# EAGLE schematic Logitech Gamepad (EAGLE 6.4)

## Sheet 1 of 6
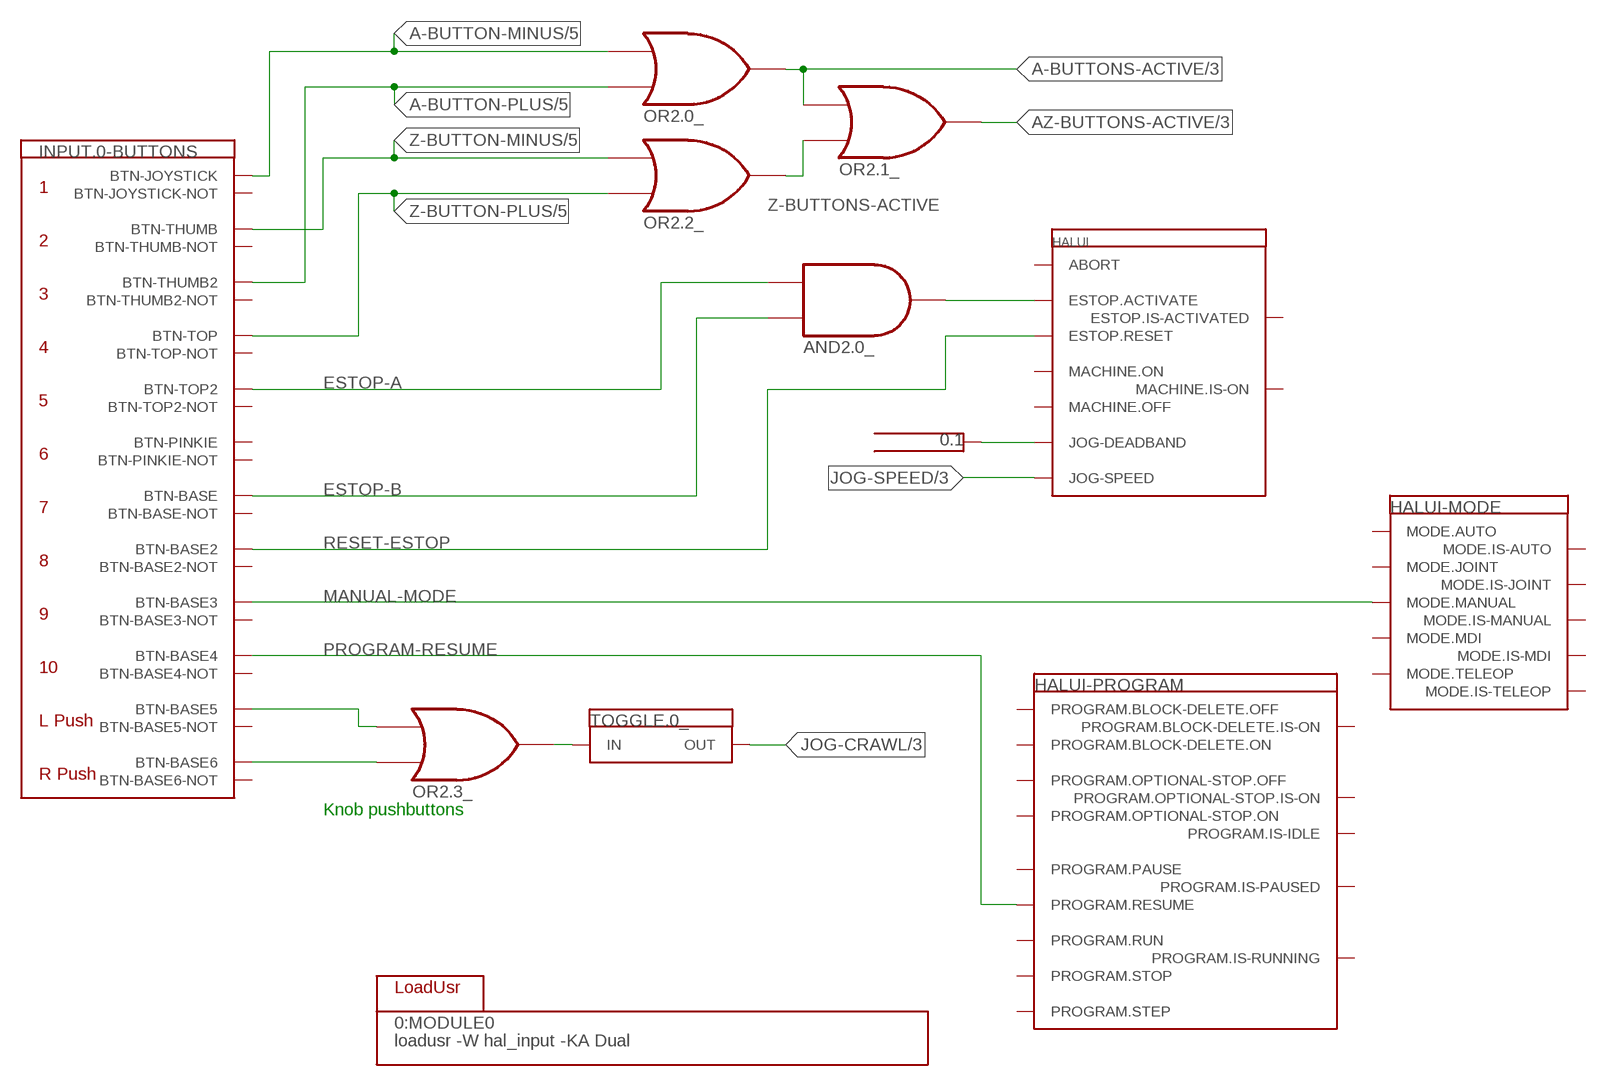
[diagram p0: schematic, sheet 1]

### Parts
AND2.0  AND2  [DUMMY]
CONSTANT.0  0.1  CONSTANT  [DUMMY]
HALUI  HALUI  [DUMMY]
INPUT.0  LOGITECH-DUAL-ACTION-GAMEPAD  [DUMMY]
OR2.0  OR2  [DUMMY]
OR2.1  OR2  [DUMMY]
OR2.2  OR2  [DUMMY]
OR2.3  OR2  [DUMMY]
TOGGLE.0  TOGGLE  [DUMMY]

### Nets
A-BUTTON-MINUS: INPUT.0.P$61(-BUTTONS:BTN-JOYSTICK) OR2.0.P$2(_:IN0) ; also sheet 5
A-BUTTON-PLUS: INPUT.0.P$67(-BUTTONS:BTN-THUMB2) OR2.0.P$3(_:IN1) ; also sheet 5
A-BUTTONS-ACTIVE: OR2.0.P$4(_:OUT) OR2.1.P$2(_:IN0) ; also sheet 3
AZ-BUTTONS-ACTIVE: OR2.1.P$4(_:OUT) ; also sheet 3,5
ESTOP-A: AND2.0.P$1(_:IN0) INPUT.0.P$71(-BUTTONS:BTN-TOP2)
ESTOP-B: AND2.0.P$2(_:IN1) INPUT.0.P$49(-BUTTONS:BTN-BASE)
JOG-CRAWL: TOGGLE.0.P$3(_:OUT) ; also sheet 3
JOG-SPEED: HALUI.P$82(JOG-SPEED) ; also sheet 3
MANUAL-MODE: HALUI.P$72(MODE.MANUAL) INPUT.0.P$53(-BUTTONS:BTN-BASE3)
N$4: AND2.0.P$3(_:OUT) HALUI.P$2(ESTOP.ACTIVATE)
N$11: INPUT.0.P$57(-BUTTONS:BTN-BASE5) OR2.3.P$2(_:IN0)
N$12: INPUT.0.P$59(-BUTTONS:BTN-BASE6) OR2.3.P$3(_:IN1)
N$15: OR2.3.P$4(_:OUT) TOGGLE.0.P$2(_:IN)
N$24: CONSTANT.0.P$2 HALUI.P$81(JOG-DEADBAND)
PROGRAM-RESUME: HALUI.P$43(PROGRAM.RESUME) INPUT.0.P$55(-BUTTONS:BTN-BASE4)
RESET-ESTOP: HALUI.P$4(ESTOP.RESET) INPUT.0.P$51(-BUTTONS:BTN-BASE2)
Z-BUTTON-MINUS: INPUT.0.P$65(-BUTTONS:BTN-THUMB) OR2.2.P$2(_:IN0) ; also sheet 5
Z-BUTTON-PLUS: INPUT.0.P$69(-BUTTONS:BTN-TOP) OR2.2.P$3(_:IN1) ; also sheet 5
Z-BUTTONS-ACTIVE: OR2.1.P$3(_:IN1) OR2.2.P$4(_:OUT)
Unconnected: HALUI.P$1(ABORT) HALUI.P$3(ESTOP.IS-ACTIVATED) HALUI.P$5(MACHINE.IS-ON) HALUI.P$6(MACHINE.OFF) HALUI.P$7(MACHINE.ON) HALUI.P$8(FLOOD.IS-ON) HALUI.P$9(FLOOD.OFF) HALUI.P$10(FLOOD.ON) HALUI.P$11(LUBE.IS-ON) HALUI.P$12(LUBE.OFF) HALUI.P$13(LUBE.ON) HALUI.P$14(MIST.IS-ON) HALUI.P$15(MIST.OFF) HALUI.P$16(MIST.ON) HALUI.P$17(FEED-OVERRIDE.COUNT-ENABLE) HALUI.P$18(FEED-OVERRIDE.COUNTS) HALUI.P$19(FEED-OVERRIDE.DECREASE) HALUI.P$20(FEED-OVERRIDE.INCREASE) HALUI.P$21(FEED-OVERRIDE.SCALE) HALUI.P$22(FEED-OVERRIDE.VALUE) HALUI.P$23(TOOL.LENGTH-OFFSET.A) HALUI.P$24(TOOL.LENGTH-OFFSET.B) HALUI.P$25(TOOL.LENGTH-OFFSET.C) HALUI.P$26(TOOL.LENGTH-OFFSET.U) HALUI.P$27(TOOL.LENGTH-OFFSET.V) HALUI.P$28(TOOL.LENGTH-OFFSET.W) HALUI.P$29(TOOL.LENGTH-OFFSET.X) HALUI.P$30(TOOL.LENGTH-OFFSET.Y) HALUI.P$31(TOOL.LENGTH-OFFSET.Z) HALUI.P$32(TOOL.NUMBER) HALUI.P$33(PROGRAM.BLOCK-DELETE.IS-ON) HALUI.P$34(PROGRAM.BLOCK-DELETE.OFF) HALUI.P$35(PROGRAM.BLOCK-DELETE.ON) HALUI.P$36(PROGRAM.IS-IDLE) HALUI.P$37(PROGRAM.IS-PAUSED) HALUI.P$38(PROGRAM.IS-RUNNING) HALUI.P$39(PROGRAM.OPTIONAL-STOP.IS-ON) HALUI.P$40(PROGRAM.OPTIONAL-STOP.OFF) HALUI.P$41(PROGRAM.OPTIONAL-STOP.ON) HALUI.P$42(PROGRAM.PAUSE) HALUI.P$44(PROGRAM.RUN) HALUI.P$45(PROGRAM.STEP) HALUI.P$46(PROGRAM.STOP) HALUI.P$47(SPINDLE-OVERRIDE.COUNT-ENABLE) HALUI.P$48(SPINDLE-OVERRIDE.COUNTS) HALUI.P$49(SPINDLE-OVERRIDE.DECREASE) HALUI.P$50(SPINDLE-OVERRIDE.INCREASE) HALUI.P$51(SPINDLE-OVERRIDE.SCALE) HALUI.P$52(SPINDLE-OVERRIDE.VALUE) HALUI.P$53(SPINDLE.BRAKE-IS-ON) HALUI.P$54(SPINDLE.BRAKE.OFF) HALUI.P$55(SPINDLE.BRAKE.ON) HALUI.P$56(SPINDLE.DECREASE) HALUI.P$57(SPINDLE.FORWARD) HALUI.P$58(SPINDLE.INCREASE) HALUI.P$59(SPINDLE.IS-ON) HALUI.P$60(SPINDLE.REVERSE) HALUI.P$61(SPINDLE.RUNS-BACKWARD) HALUI.P$62(SPINDLE.RUNS-FORWARD) HALUI.P$63(SPINDLE.START) HALUI.P$64(SPINDLE.STOP) HALUI.P$65(MODE.AUTO) HALUI.P$66(MODE.IS-AUTO) HALUI.P$67(MODE.IS-JOINT) HALUI.P$68(MODE.IS-MANUAL) HALUI.P$69(MODE.IS-MDI) HALUI.P$70(MODE.IS-TELEOP) HALUI.P$71(MODE.JOINT) HALUI.P$73(MODE.MDI) HALUI.P$74(MODE.TELEOP) HALUI.P$75(MAX-VELOCITY.COUNT-ENABLE) HALUI.P$76(MAX-VELOCITY.COUNTS) HALUI.P$77(MAX-VELOCITY.DECREASE) HALUI.P$78(MAX-VELOCITY.INCREASE) HALUI.P$79(MAX-VELOCITY.SCALE) HALUI.P$80(MAX-VELOCITY.VALUE) INPUT.0.P$50(-BUTTONS:BTN-BASE-NOT) INPUT.0.P$52(-BUTTONS:BTN-BASE2-NOT) INPUT.0.P$54(-BUTTONS:BTN-BASE3-NOT) INPUT.0.P$56(-BUTTONS:BTN-BASE4-NOT) INPUT.0.P$58(-BUTTONS:BTN-BASE5-NOT) INPUT.0.P$60(-BUTTONS:BTN-BASE6-NOT) INPUT.0.P$62(-BUTTONS:BTN-JOYSTICK-NOT) INPUT.0.P$63(-BUTTONS:BTN-PINKIE) INPUT.0.P$64(-BUTTONS:BTN-PINKIE-NOT) INPUT.0.P$66(-BUTTONS:BTN-THUMB-NOT) INPUT.0.P$68(-BUTTONS:BTN-THUMB2-NOT) INPUT.0.P$70(-BUTTONS:BTN-TOP-NOT) INPUT.0.P$72(-BUTTONS:BTN-TOP2-NOT) INPUT.0.P$73(.ABS-HAT0X-MAX:PIN_PARAMETER) INPUT.0.P$74(.ABS-HAT0X-MIN:PIN_PARAMETER) INPUT.0.P$75(.ABS-HAT0Y-MAX:PIN_PARAMETER) INPUT.0.P$76(.ABS-HAT0Y-MIN:PIN_PARAMETER) INPUT.0.P$77(.ABS-RZ-MAX:PIN_PARAMETER) INPUT.0.P$78(.ABS-RZ-MIN:PIN_PARAMETER) INPUT.0.P$79(.ABS-X-MAX:PIN_PARAMETER) INPUT.0.P$80(.ABS-X-MIN:PIN_PARAMETER) INPUT.0.P$81(.ABS-Y-MAX:PIN_PARAMETER) INPUT.0.P$82(.ABS-Y-MIN:PIN_PARAMETER) INPUT.0.P$83(.ABS-Z-MAX:PIN_PARAMETER) INPUT.0.P$84(.ABS-Z-MIN:PIN_PARAMETER) TOGGLE.0.P$4(.DEBOUNCE:PIN_PARAMETER)

### Notes on the sheet
- Knob pushbuttons

## Sheet 2 of 6
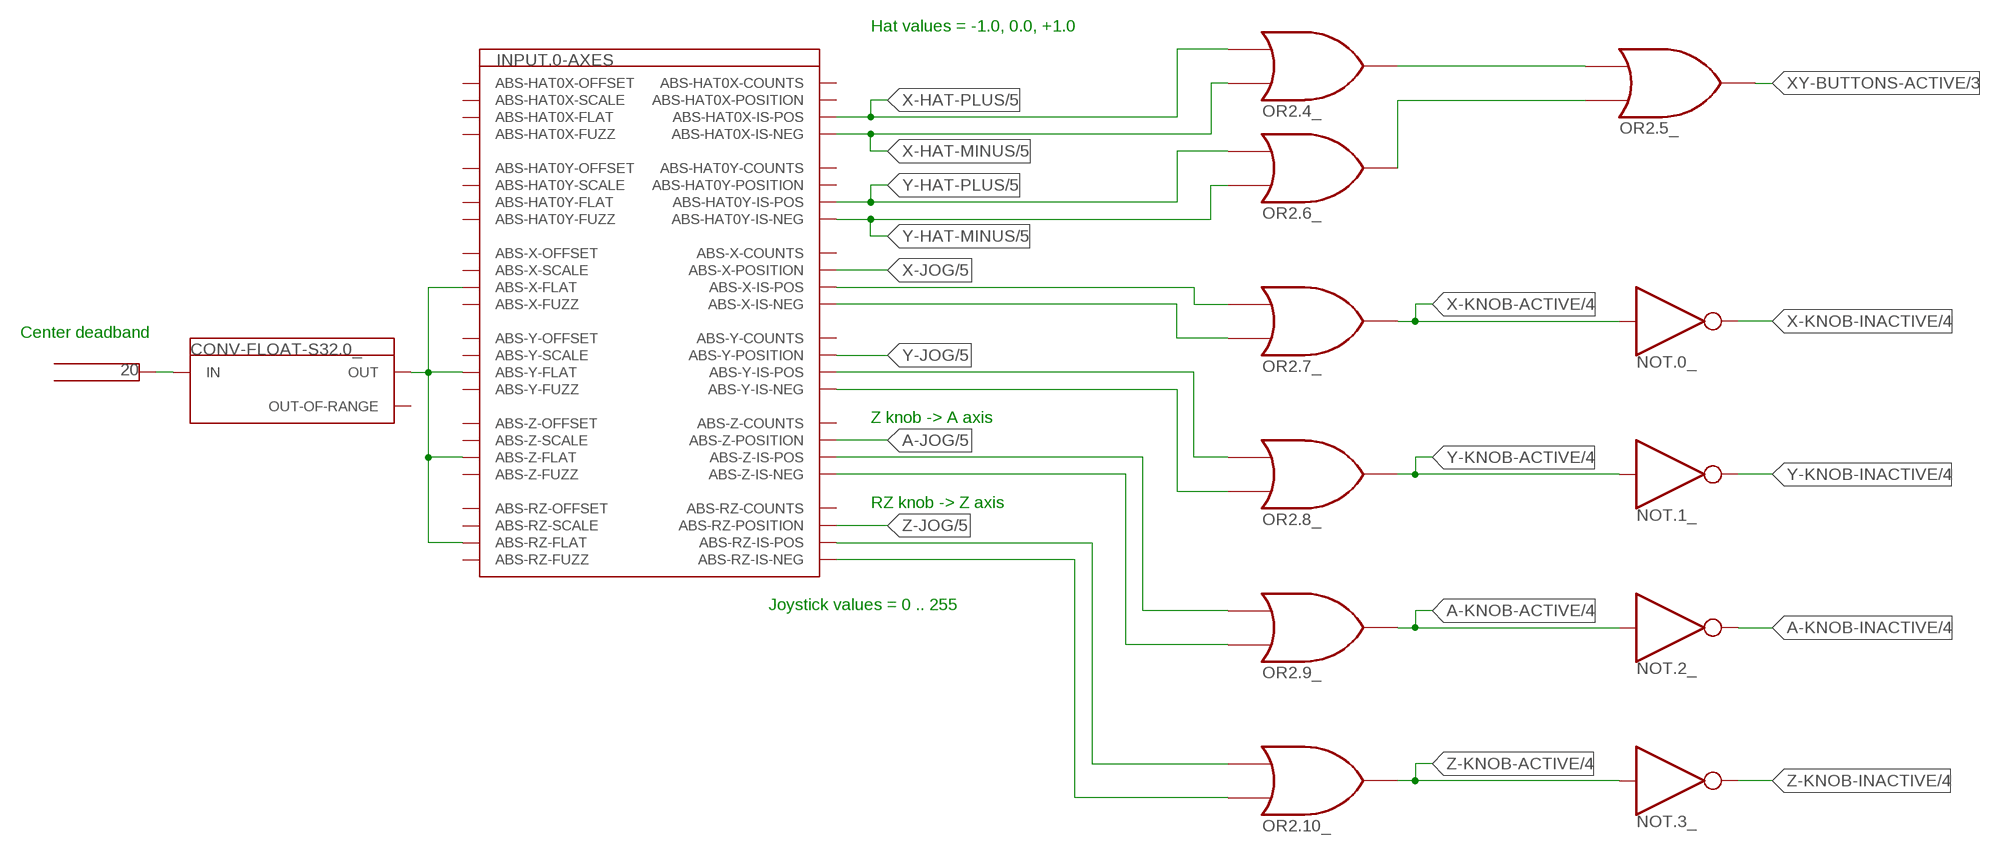
[diagram p1: schematic, sheet 2]

### Parts
CONSTANT.1  20  CONSTANT  [DUMMY]
CONV-FLOAT-S32.0  CONV_FLOAT_S32  [DUMMY]
NOT.0  NOT  [DUMMY]
NOT.1  NOT  [DUMMY]
NOT.2  NOT  [DUMMY]
NOT.3  NOT  [DUMMY]
OR2.4  OR2  [DUMMY]
OR2.5  OR2  [DUMMY]
OR2.6  OR2  [DUMMY]
OR2.7  OR2  [DUMMY]
OR2.8  OR2  [DUMMY]
OR2.9  OR2  [DUMMY]
OR2.10  OR2  [DUMMY]

### Nets
A-JOG: INPUT.0.P$47(-AXES:ABS-Z-POSITION) ; also sheet 5
A-KNOB-ACTIVE: NOT.2.P$1(_:IN) OR2.9.P$4(_:OUT) ; also sheet 4
A-KNOB-INACTIVE: NOT.2.P$2(_:OUT) ; also sheet 4
N$6: CONV-FLOAT-S32.0.P$4(_:OUT) INPUT.0.P$18(-AXES:ABS-RZ-FLAT) INPUT.0.P$26(-AXES:ABS-X-FLAT) INPUT.0.P$34(-AXES:ABS-Y-FLAT) INPUT.0.P$42(-AXES:ABS-Z-FLAT)
N$8: CONSTANT.1.P$2 CONV-FLOAT-S32.0.P$3(_:IN)
N$42: INPUT.0.P$29(-AXES:ABS-X-IS-POS) OR2.7.P$2(_:IN0)
N$43: INPUT.0.P$28(-AXES:ABS-X-IS-NEG) OR2.7.P$3(_:IN1)
N$44: INPUT.0.P$37(-AXES:ABS-Y-IS-POS) OR2.8.P$2(_:IN0)
N$45: INPUT.0.P$36(-AXES:ABS-Y-IS-NEG) OR2.8.P$3(_:IN1)
N$46: INPUT.0.P$45(-AXES:ABS-Z-IS-POS) OR2.9.P$2(_:IN0)
N$47: INPUT.0.P$44(-AXES:ABS-Z-IS-NEG) OR2.9.P$3(_:IN1)
N$48: INPUT.0.P$21(-AXES:ABS-RZ-IS-POS) OR2.10.P$2(_:IN0)
N$49: INPUT.0.P$20(-AXES:ABS-RZ-IS-NEG) OR2.10.P$3(_:IN1)
X-BUTTONS-ACTIVE: OR2.4.P$4(_:OUT) OR2.5.P$2(_:IN0)
X-HAT-MINUS: INPUT.0.P$4(-AXES:ABS-HAT0X-IS-NEG) OR2.4.P$3(_:IN1) ; also sheet 5
X-HAT-PLUS: INPUT.0.P$5(-AXES:ABS-HAT0X-IS-POS) OR2.4.P$2(_:IN0) ; also sheet 5
X-JOG: INPUT.0.P$31(-AXES:ABS-X-POSITION) ; also sheet 5
X-KNOB-ACTIVE: NOT.0.P$1(_:IN) OR2.7.P$4(_:OUT) ; also sheet 4
X-KNOB-INACTIVE: NOT.0.P$2(_:OUT) ; also sheet 4
XY-BUTTONS-ACTIVE: OR2.5.P$4(_:OUT) ; also sheet 3,5
Y-BUTTONS-ACTIVE: OR2.5.P$3(_:IN1) OR2.6.P$4(_:OUT)
Y-HAT-MINUS: INPUT.0.P$16(-AXES:ABS-HAT0Y-IS-NEG) OR2.6.P$3(_:IN1) ; also sheet 5
Y-HAT-PLUS: INPUT.0.P$12(-AXES:ABS-HAT0Y-IS-POS) OR2.6.P$2(_:IN0) ; also sheet 5
Y-JOG: INPUT.0.P$39(-AXES:ABS-Y-POSITION) ; also sheet 5
Y-KNOB-ACTIVE: NOT.1.P$1(_:IN) OR2.8.P$4(_:OUT) ; also sheet 4
Y-KNOB-INACTIVE: NOT.1.P$2(_:OUT) ; also sheet 4
Z-JOG: INPUT.0.P$23(-AXES:ABS-RZ-POSITION) ; also sheet 5
Z-KNOB-ACTIVE: NOT.3.P$1(_:IN) OR2.10.P$4(_:OUT) ; also sheet 4
Z-KNOB-INACTIVE: NOT.3.P$2(_:OUT) ; also sheet 4
Unconnected: CONV-FLOAT-S32.0.P$2(.CLAMP:PIN_PARAMETER) CONV-FLOAT-S32.0.P$5(_:OUT-OF-RANGE) INPUT.0.P$1(-AXES:ABS-HAT0X-COUNTS) INPUT.0.P$2(-AXES:ABS-HAT0X-FLAT) INPUT.0.P$3(-AXES:ABS-HAT0X-FUZZ) INPUT.0.P$6(-AXES:ABS-HAT0X-OFFSET) INPUT.0.P$7(-AXES:ABS-HAT0X-POSITION) INPUT.0.P$8(-AXES:ABS-HAT0X-SCALE) INPUT.0.P$9(-AXES:ABS-HAT0Y-COUNTS) INPUT.0.P$10(-AXES:ABS-HAT0Y-FLAT) INPUT.0.P$11(-AXES:ABS-HAT0Y-FUZZ) INPUT.0.P$13(-AXES:ABS-HAT0Y-OFFSET) INPUT.0.P$14(-AXES:ABS-HAT0Y-POSITION) INPUT.0.P$15(-AXES:ABS-HAT0Y-SCALE) INPUT.0.P$17(-AXES:ABS-RZ-COUNTS) INPUT.0.P$19(-AXES:ABS-RZ-FUZZ) INPUT.0.P$22(-AXES:ABS-RZ-OFFSET) INPUT.0.P$24(-AXES:ABS-RZ-SCALE) INPUT.0.P$25(-AXES:ABS-X-COUNTS) INPUT.0.P$27(-AXES:ABS-X-FUZZ) INPUT.0.P$30(-AXES:ABS-X-OFFSET) INPUT.0.P$32(-AXES:ABS-X-SCALE) INPUT.0.P$33(-AXES:ABS-Y-COUNTS) INPUT.0.P$35(-AXES:ABS-Y-FUZZ) INPUT.0.P$38(-AXES:ABS-Y-OFFSET) INPUT.0.P$40(-AXES:ABS-Y-SCALE) INPUT.0.P$41(-AXES:ABS-Z-COUNTS) INPUT.0.P$43(-AXES:ABS-Z-FUZZ) INPUT.0.P$46(-AXES:ABS-Z-OFFSET) INPUT.0.P$48(-AXES:ABS-Z-SCALE)

### Notes on the sheet
- Hat values = -1.0, 0.0, +1.0
- Center deadband
- Z knob -> A axis
- RZ knob -> Z axis
- Joystick values = 0 .. 255

## Sheet 3 of 6
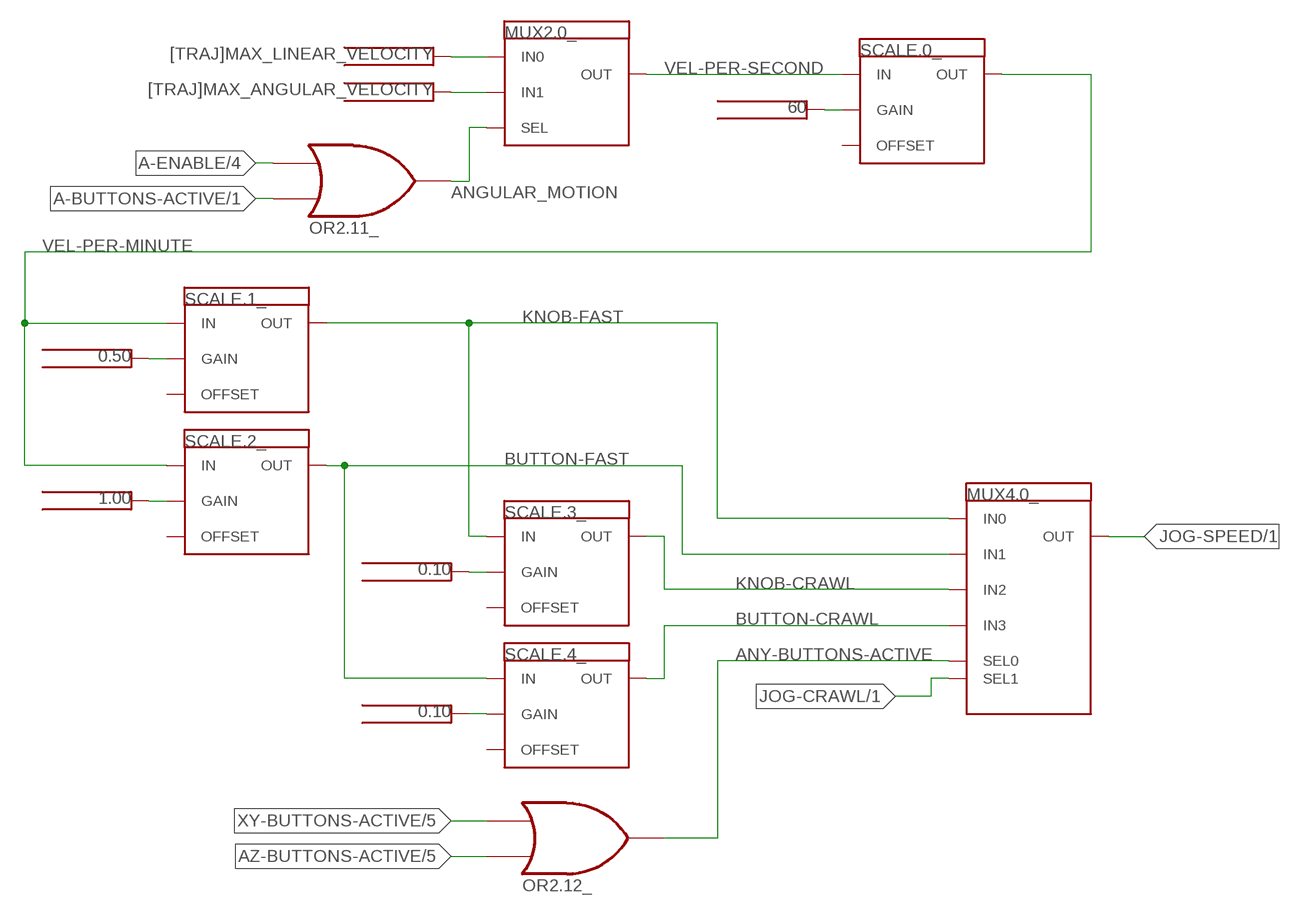
[diagram p2: schematic, sheet 3]

### Parts
CONSTANT.2  [TRAJ]MAX_LINEAR_VELOCITY  CONSTANT  [DUMMY]
CONSTANT.3  [TRAJ]MAX_ANGULAR_VELOCITY  CONSTANT  [DUMMY]
CONSTANT.4  60  CONSTANT  [DUMMY]
CONSTANT.5  0.50  CONSTANT  [DUMMY]
CONSTANT.6  1.00  CONSTANT  [DUMMY]
CONSTANT.7  0.10  CONSTANT  [DUMMY]
CONSTANT.8  0.10  CONSTANT  [DUMMY]
MUX2.0  MUX2  [DUMMY]
MUX4.0  MUX4  [DUMMY]
OR2.11  OR2  [DUMMY]
OR2.12  OR2  [DUMMY]
SCALE.0  SCALE  [DUMMY]
SCALE.1  SCALE  [DUMMY]
SCALE.2  SCALE  [DUMMY]
SCALE.3  SCALE  [DUMMY]
SCALE.4  SCALE  [DUMMY]

### Nets
A-BUTTONS-ACTIVE: OR2.11.P$3(_:IN1) ; also sheet 1
A-ENABLE: OR2.11.P$2(_:IN0) ; also sheet 4,5
ANGULAR_MOTION: MUX2.0.P$5(_:SEL) OR2.11.P$4(_:OUT)
ANY-BUTTONS-ACTIVE: MUX4.0.P$7(_:SEL0) OR2.12.P$4(_:OUT)
AZ-BUTTONS-ACTIVE: OR2.12.P$3(_:IN1) ; also sheet 1,5
BUTTON-CRAWL: MUX4.0.P$5(_:IN3) SCALE.4.P$5(_:OUT)
BUTTON-FAST: MUX4.0.P$3(_:IN1) SCALE.2.P$5(_:OUT) SCALE.4.P$3(_:IN)
JOG-CRAWL: MUX4.0.P$8(_:SEL1) ; also sheet 1
JOG-SPEED: MUX4.0.P$6(_:OUT) ; also sheet 1
KNOB-CRAWL: MUX4.0.P$4(_:IN2) SCALE.3.P$5(_:OUT)
KNOB-FAST: MUX4.0.P$2(_:IN0) SCALE.1.P$5(_:OUT) SCALE.3.P$3(_:IN)
N$1: CONSTANT.2.P$2 MUX2.0.P$2(_:IN0)
N$9: CONSTANT.3.P$2 MUX2.0.P$3(_:IN1)
N$16: CONSTANT.4.P$2 SCALE.0.P$2(_:GAIN)
N$17: CONSTANT.5.P$2 SCALE.1.P$2(_:GAIN)
N$18: CONSTANT.6.P$2 SCALE.2.P$2(_:GAIN)
N$19: CONSTANT.7.P$2 SCALE.3.P$2(_:GAIN)
N$20: CONSTANT.8.P$2 SCALE.4.P$2(_:GAIN)
VEL-PER-MINUTE: SCALE.0.P$5(_:OUT) SCALE.1.P$3(_:IN) SCALE.2.P$3(_:IN)
VEL-PER-SECOND: MUX2.0.P$4(_:OUT) SCALE.0.P$3(_:IN)
XY-BUTTONS-ACTIVE: OR2.12.P$2(_:IN0) ; also sheet 2,5
Unconnected: SCALE.0.P$4(_:OFFSET) SCALE.1.P$4(_:OFFSET) SCALE.2.P$4(_:OFFSET) SCALE.3.P$4(_:OFFSET) SCALE.4.P$4(_:OFFSET)

## Sheet 4 of 6
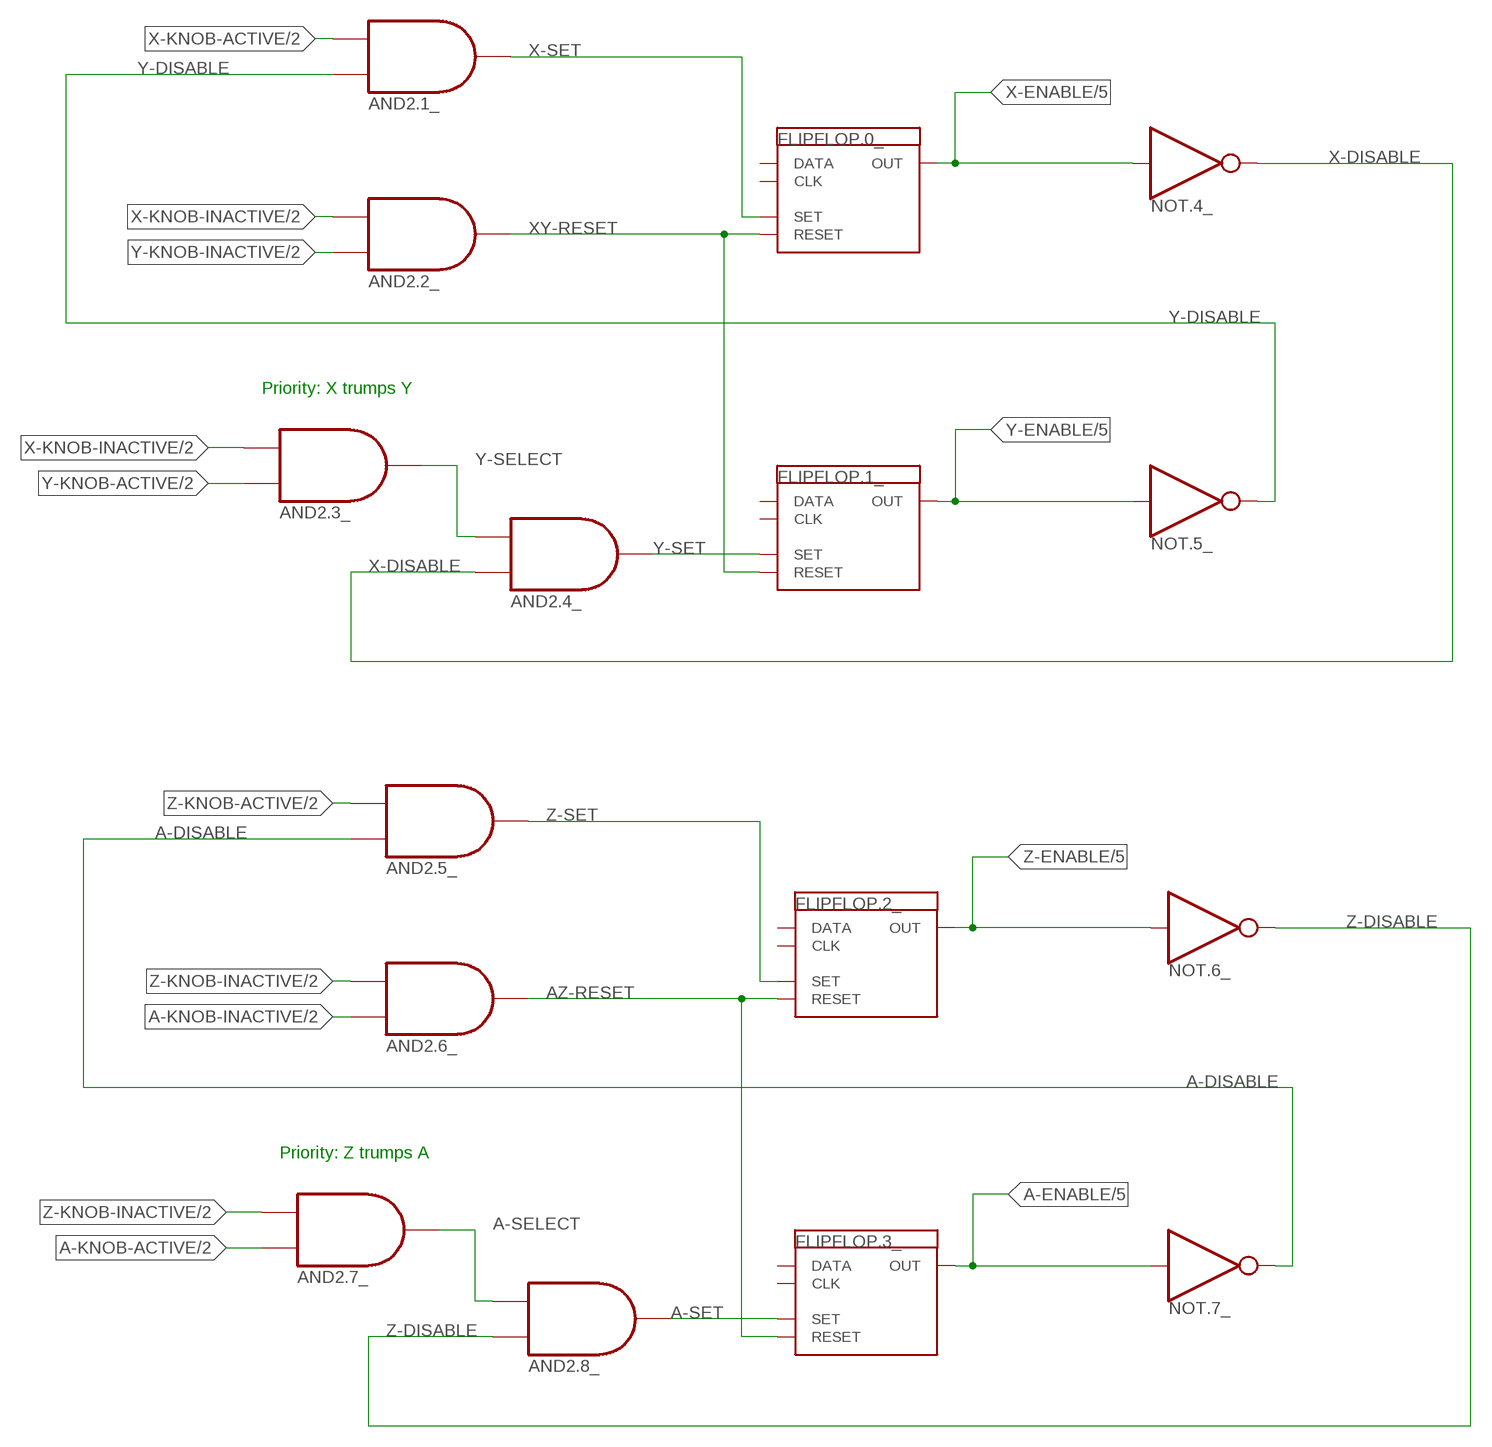
[diagram p3: schematic, sheet 4]

### Parts
AND2.1  AND2  [DUMMY]
AND2.2  AND2  [DUMMY]
AND2.3  AND2  [DUMMY]
AND2.4  AND2  [DUMMY]
AND2.5  AND2  [DUMMY]
AND2.6  AND2  [DUMMY]
AND2.7  AND2  [DUMMY]
AND2.8  AND2  [DUMMY]
FLIPFLOP.0  FLIPFLOP  [DUMMY]
FLIPFLOP.1  FLIPFLOP  [DUMMY]
FLIPFLOP.2  FLIPFLOP  [DUMMY]
FLIPFLOP.3  FLIPFLOP  [DUMMY]
NOT.4  NOT  [DUMMY]
NOT.5  NOT  [DUMMY]
NOT.6  NOT  [DUMMY]
NOT.7  NOT  [DUMMY]

### Nets
A-DISABLE: AND2.5.P$2(_:IN1) NOT.7.P$2(_:OUT)
A-ENABLE: FLIPFLOP.3.P$3(_:OUT) NOT.7.P$1(_:IN) ; also sheet 3,5
A-KNOB-ACTIVE: AND2.7.P$2(_:IN1) ; also sheet 2
A-KNOB-INACTIVE: AND2.6.P$2(_:IN1) ; also sheet 2
A-SELECT: AND2.7.P$3(_:OUT) AND2.8.P$1(_:IN0)
A-SET: AND2.8.P$3(_:OUT) FLIPFLOP.3.P$5(_:SET)
AZ-RESET: AND2.6.P$3(_:OUT) FLIPFLOP.2.P$4(_:RESET) FLIPFLOP.3.P$4(_:RESET)
X-DISABLE: AND2.4.P$2(_:IN1) NOT.4.P$2(_:OUT)
X-ENABLE: FLIPFLOP.0.P$3(_:OUT) NOT.4.P$1(_:IN) ; also sheet 5
X-KNOB-ACTIVE: AND2.1.P$1(_:IN0) ; also sheet 2
X-KNOB-INACTIVE: AND2.2.P$1(_:IN0) AND2.3.P$1(_:IN0) ; also sheet 2
X-SET: AND2.1.P$3(_:OUT) FLIPFLOP.0.P$5(_:SET)
XY-RESET: AND2.2.P$3(_:OUT) FLIPFLOP.0.P$4(_:RESET) FLIPFLOP.1.P$4(_:RESET)
Y-DISABLE: AND2.1.P$2(_:IN1) NOT.5.P$2(_:OUT)
Y-ENABLE: FLIPFLOP.1.P$3(_:OUT) NOT.5.P$1(_:IN) ; also sheet 5
Y-KNOB-ACTIVE: AND2.3.P$2(_:IN1) ; also sheet 2
Y-KNOB-INACTIVE: AND2.2.P$2(_:IN1) ; also sheet 2
Y-SELECT: AND2.3.P$3(_:OUT) AND2.4.P$1(_:IN0)
Y-SET: AND2.4.P$3(_:OUT) FLIPFLOP.1.P$5(_:SET)
Z-DISABLE: AND2.8.P$2(_:IN1) NOT.6.P$2(_:OUT)
Z-ENABLE: FLIPFLOP.2.P$3(_:OUT) NOT.6.P$1(_:IN) ; also sheet 5
Z-KNOB-ACTIVE: AND2.5.P$1(_:IN0) ; also sheet 2
Z-KNOB-INACTIVE: AND2.6.P$1(_:IN0) AND2.7.P$1(_:IN0) ; also sheet 2
Z-SET: AND2.5.P$3(_:OUT) FLIPFLOP.2.P$5(_:SET)
Unconnected: FLIPFLOP.0.P$1(_:CLK) FLIPFLOP.0.P$2(_:DATA) FLIPFLOP.1.P$1(_:CLK) FLIPFLOP.1.P$2(_:DATA) FLIPFLOP.2.P$1(_:CLK) FLIPFLOP.2.P$2(_:DATA) FLIPFLOP.3.P$1(_:CLK) FLIPFLOP.3.P$2(_:DATA)

### Notes on the sheet
- Priority: X trumps Y
- Priority: Z trumps A

## Sheet 5 of 6
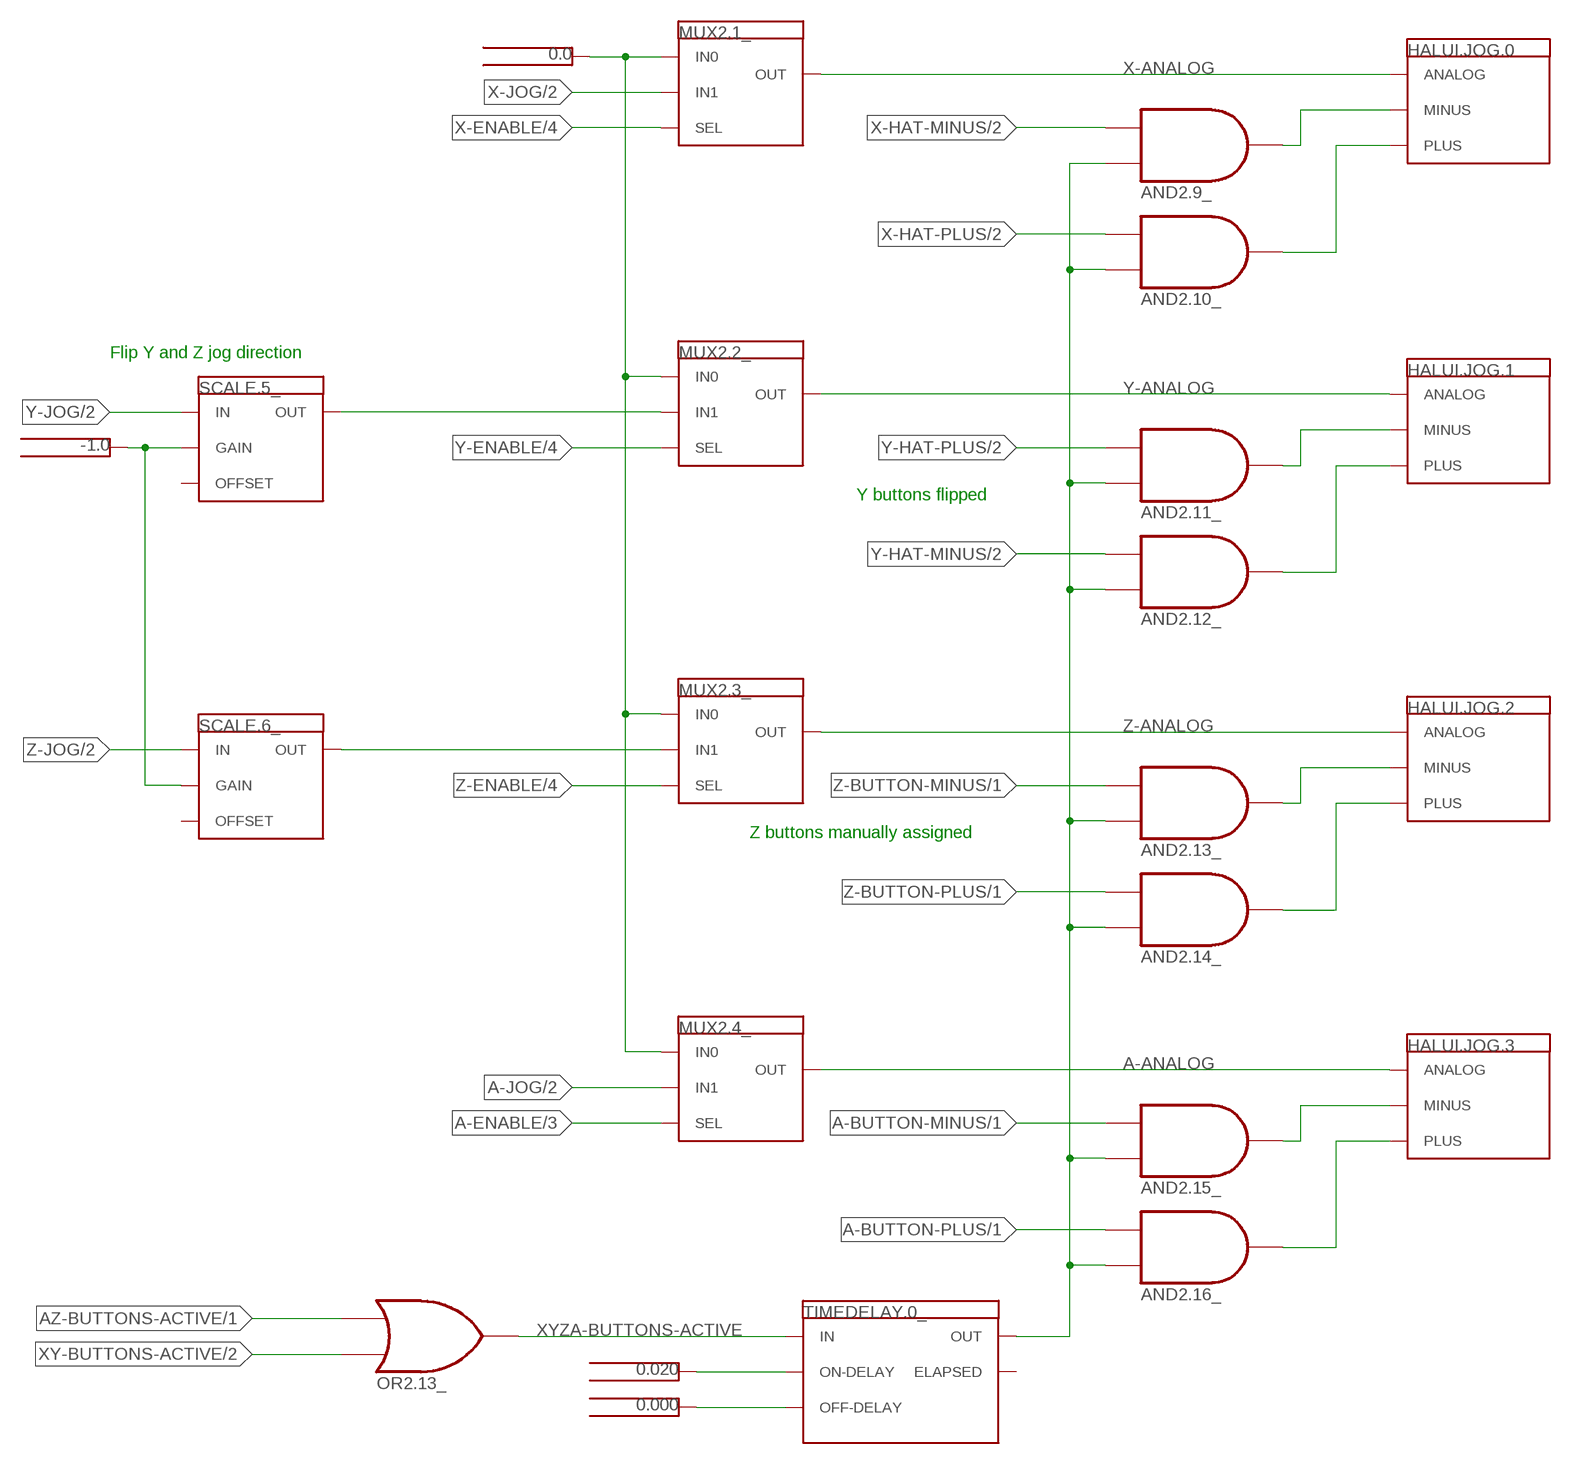
[diagram p4: schematic, sheet 5]

### Parts
AND2.9  AND2  [DUMMY]
AND2.10  AND2  [DUMMY]
AND2.11  AND2  [DUMMY]
AND2.12  AND2  [DUMMY]
AND2.13  AND2  [DUMMY]
AND2.14  AND2  [DUMMY]
AND2.15  AND2  [DUMMY]
AND2.16  AND2  [DUMMY]
CONSTANT.9  0.0  CONSTANT  [DUMMY]
CONSTANT.10  -1.0  CONSTANT  [DUMMY]
CONSTANT.11  0.020  CONSTANT  [DUMMY]
CONSTANT.12  0.000  CONSTANT  [DUMMY]
HALUI.JOG.0  HALUI.JOG  [DUMMY]
HALUI.JOG.1  HALUI.JOG  [DUMMY]
HALUI.JOG.2  HALUI.JOG  [DUMMY]
HALUI.JOG.3  HALUI.JOG  [DUMMY]
MUX2.1  MUX2  [DUMMY]
MUX2.2  MUX2  [DUMMY]
MUX2.3  MUX2  [DUMMY]
MUX2.4  MUX2  [DUMMY]
OR2.13  OR2  [DUMMY]
SCALE.5  SCALE  [DUMMY]
SCALE.6  SCALE  [DUMMY]
TIMEDELAY.0  TIMEDELAY  [DUMMY]

### Nets
A-ANALOG: HALUI.JOG.3.P$1(ANALOG) MUX2.4.P$4(_:OUT)
A-BUTTON-MINUS: AND2.15.P$1(_:IN0) ; also sheet 1
A-BUTTON-PLUS: AND2.16.P$1(_:IN0) ; also sheet 1
A-ENABLE: MUX2.4.P$5(_:SEL) ; also sheet 3,4
A-JOG: MUX2.4.P$3(_:IN1) ; also sheet 2
AZ-BUTTONS-ACTIVE: OR2.13.P$2(_:IN0) ; also sheet 1,3
N$10: CONSTANT.10.P$2 SCALE.5.P$2(_:GAIN) SCALE.6.P$2(_:GAIN)
N$13: CONSTANT.9.P$2 MUX2.1.P$2(_:IN0) MUX2.2.P$2(_:IN0) MUX2.3.P$2(_:IN0) MUX2.4.P$2(_:IN0)
N$22: MUX2.2.P$3(_:IN1) SCALE.5.P$5(_:OUT)
N$23: MUX2.3.P$3(_:IN1) SCALE.6.P$5(_:OUT)
N$29: AND2.9.P$2(_:IN1) AND2.10.P$2(_:IN1) AND2.11.P$2(_:IN1) AND2.12.P$2(_:IN1) AND2.13.P$2(_:IN1) AND2.14.P$2(_:IN1) AND2.15.P$2(_:IN1) AND2.16.P$2(_:IN1) TIMEDELAY.0.P$5(OUT)
N$30: AND2.9.P$3(_:OUT) HALUI.JOG.0.P$2(MINUS)
N$32: CONSTANT.11.P$2 TIMEDELAY.0.P$4(ON-DELAY)
N$33: CONSTANT.12.P$2 TIMEDELAY.0.P$3(OFF-DELAY)
N$34: AND2.10.P$3(_:OUT) HALUI.JOG.0.P$3(PLUS)
N$35: AND2.11.P$3(_:OUT) HALUI.JOG.1.P$2(MINUS)
N$36: AND2.12.P$3(_:OUT) HALUI.JOG.1.P$3(PLUS)
N$37: AND2.13.P$3(_:OUT) HALUI.JOG.2.P$2(MINUS)
N$38: AND2.14.P$3(_:OUT) HALUI.JOG.2.P$3(PLUS)
N$39: AND2.15.P$3(_:OUT) HALUI.JOG.3.P$2(MINUS)
N$40: AND2.16.P$3(_:OUT) HALUI.JOG.3.P$3(PLUS)
X-ANALOG: HALUI.JOG.0.P$1(ANALOG) MUX2.1.P$4(_:OUT)
X-ENABLE: MUX2.1.P$5(_:SEL) ; also sheet 4
X-HAT-MINUS: AND2.9.P$1(_:IN0) ; also sheet 2
X-HAT-PLUS: AND2.10.P$1(_:IN0) ; also sheet 2
X-JOG: MUX2.1.P$3(_:IN1) ; also sheet 2
XY-BUTTONS-ACTIVE: OR2.13.P$3(_:IN1) ; also sheet 2,3
XYZA-BUTTONS-ACTIVE: OR2.13.P$4(_:OUT) TIMEDELAY.0.P$2(IN)
Y-ANALOG: HALUI.JOG.1.P$1(ANALOG) MUX2.2.P$4(_:OUT)
Y-ENABLE: MUX2.2.P$5(_:SEL) ; also sheet 4
Y-HAT-MINUS: AND2.12.P$1(_:IN0) ; also sheet 2
Y-HAT-PLUS: AND2.11.P$1(_:IN0) ; also sheet 2
Y-JOG: SCALE.5.P$3(_:IN) ; also sheet 2
Z-ANALOG: HALUI.JOG.2.P$1(ANALOG) MUX2.3.P$4(_:OUT)
Z-BUTTON-MINUS: AND2.13.P$1(_:IN0) ; also sheet 1
Z-BUTTON-PLUS: AND2.14.P$1(_:IN0) ; also sheet 1
Z-ENABLE: MUX2.3.P$5(_:SEL) ; also sheet 4
Z-JOG: SCALE.6.P$3(_:IN) ; also sheet 2
Unconnected: SCALE.5.P$4(_:OFFSET) SCALE.6.P$4(_:OFFSET) TIMEDELAY.0.P$1(ELAPSED)

### Notes on the sheet
- Flip Y and Z jog direction
- Y buttons flipped
- Z buttons manually assigned

## Sheet 6 of 6
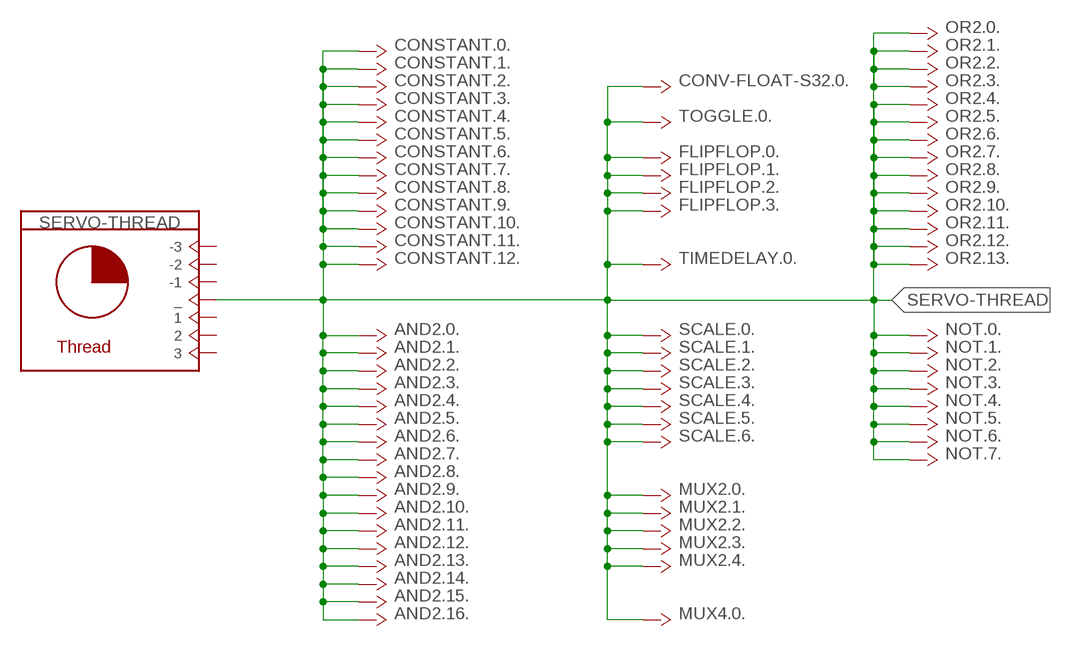
[diagram p5: schematic, sheet 6]

### Parts
SERVO-THREAD  THREAD  [DUMMY]

### Nets
SERVO-THREAD: AND2.0.P$4(.:PIN_THREAD) AND2.1.P$4(.:PIN_THREAD) AND2.2.P$4(.:PIN_THREAD) AND2.3.P$4(.:PIN_THREAD) AND2.4.P$4(.:PIN_THREAD) AND2.5.P$4(.:PIN_THREAD) AND2.6.P$4(.:PIN_THREAD) AND2.7.P$4(.:PIN_THREAD) AND2.8.P$4(.:PIN_THREAD) AND2.9.P$4(.:PIN_THREAD) AND2.10.P$4(.:PIN_THREAD) AND2.11.P$4(.:PIN_THREAD) AND2.12.P$4(.:PIN_THREAD) AND2.13.P$4(.:PIN_THREAD) AND2.14.P$4(.:PIN_THREAD) AND2.15.P$4(.:PIN_THREAD) AND2.16.P$4(.:PIN_THREAD) CONSTANT.0.P$1 CONSTANT.1.P$1 CONSTANT.2.P$1 CONSTANT.3.P$1 CONSTANT.4.P$1 CONSTANT.5.P$1 CONSTANT.6.P$1 CONSTANT.7.P$1 CONSTANT.8.P$1 CONSTANT.9.P$1 CONSTANT.10.P$1 CONSTANT.11.P$1 CONSTANT.12.P$1 CONV-FLOAT-S32.0.P$1(.:PIN_THREAD) FLIPFLOP.0.P$6(.:PIN_THREAD) FLIPFLOP.1.P$6(.:PIN_THREAD) FLIPFLOP.2.P$6(.:PIN_THREAD) FLIPFLOP.3.P$6(.:PIN_THREAD) MUX2.0.P$1(.:PIN_THREAD) MUX2.1.P$1(.:PIN_THREAD) MUX2.2.P$1(.:PIN_THREAD) MUX2.3.P$1(.:PIN_THREAD) MUX2.4.P$1(.:PIN_THREAD) MUX4.0.P$1(.:PIN_THREAD) NOT.0.P$3(.:PIN_THREAD) NOT.1.P$3(.:PIN_THREAD) NOT.2.P$3(.:PIN_THREAD) NOT.3.P$3(.:PIN_THREAD) NOT.4.P$3(.:PIN_THREAD) NOT.5.P$3(.:PIN_THREAD) NOT.6.P$3(.:PIN_THREAD) NOT.7.P$3(.:PIN_THREAD) OR2.0.P$1(.:PIN_THREAD) OR2.1.P$1(.:PIN_THREAD) OR2.2.P$1(.:PIN_THREAD) OR2.3.P$1(.:PIN_THREAD) OR2.4.P$1(.:PIN_THREAD) OR2.5.P$1(.:PIN_THREAD) OR2.6.P$1(.:PIN_THREAD) OR2.7.P$1(.:PIN_THREAD) OR2.8.P$1(.:PIN_THREAD) OR2.9.P$1(.:PIN_THREAD) OR2.10.P$1(.:PIN_THREAD) OR2.11.P$1(.:PIN_THREAD) OR2.12.P$1(.:PIN_THREAD) OR2.13.P$1(.:PIN_THREAD) SCALE.0.P$1(.:PIN_THREAD) SCALE.1.P$1(.:PIN_THREAD) SCALE.2.P$1(.:PIN_THREAD) SCALE.3.P$1(.:PIN_THREAD) SCALE.4.P$1(.:PIN_THREAD) SCALE.5.P$1(.:PIN_THREAD) SCALE.6.P$1(.:PIN_THREAD) SERVO-THREAD.P$7(_) TIMEDELAY.0.P$6(PIN_THREAD) TOGGLE.0.P$1(.:PIN_THREAD)
Unconnected: SERVO-THREAD.P$1(-1) SERVO-THREAD.P$2(-2) SERVO-THREAD.P$3(-3) SERVO-THREAD.P$4 SERVO-THREAD.P$5 SERVO-THREAD.P$6

## Library data of the parts
AND2.0 AND2.1-AND2.16 = hal-config:AND2: HAL AND2 Boolean 2-input AND
CONSTANT.0 CONSTANT.1-CONSTANT.12 = hal-config:CONSTANT: Emit constant value Rename first device: constant.1 -> constant.0
CONV-FLOAT-S32.0 = hal-config:CONV_FLOAT_S32: CONV_FLOAT_S32 NAME conv_float_s32 − Convert a value from float to s32 SYNOPSIS loadrt conv_float_s32 [count=N|names=name1[,name2...]] FUNCTIONS conv-float-s32.N (requires a floating-point thread) Update ’out’ based on ’in’ PINS conv-float-s32.N.in float in conv-float-s32.N.out s32 out conv-float-s32.N.out-of-range bit out TRUE when ’in’ is not in the range of s32 PARAMETERS conv-float-s32.N.clamp bit rw If TRUE, then clamp to the range of s32. If FALSE, then allow the value to "wrap around". LICENSE GPL
FLIPFLOP.0 FLIPFLOP.1-FLIPFLOP.3 = hal-config:FLIPFLOP: FLIPFLOP NAME flipflop − D type flip-flop SYNOPSIS loadrt flipflop [count=N|names=name1[,name2...]] FUNCTIONS flipflop.N PINS flipflop.N.data bit in data input flipflop.N.clk bit in clock, rising edge writes data to out flipflop.N.set bit in when true, force out true flipflop.N.reset bit in when true, force out false; overrides set flipflop.N.out bit io output LICENSE GPL
HALUI = hal-config:HALUI: HalUI Interface to HAL Because there can be only one HALUI, you must delete the device number after placement: HALUI.1 -> HALUI Invoke the HALUI device to add other blocks. Axis, jogs, and joints are in separate devices to allow automagic device numbering.
HALUI.JOG.0 HALUI.JOG.1-HALUI.JOG.3 = hal-config:HALUI.JOG: Device for jogging individual joint Add one halui.jog device for each joint Rename first device after placing: halui.jog.1 -> halui.jog.0 Add halui.jogsel device to get common jog pins
INPUT.0 = hal-config:LOGITECH-DUAL-ACTION-GAMEPAD: Logitech Dual Action Gamepad Add one device for each gamepad Rename input.1 -> input.0
MUX2.0 MUX2.1-MUX2.4 = hal-config:MUX2: Select 1 of 2 inputs Rename first device: mux2.1 -> mux2.0
MUX4.0 = hal-config:MUX4: Select 1 of 4 inputs Rename first device: mux4.1 -> mux4.0
NOT.0 NOT.1-NOT.7 = hal-config:NOT: HAL NOT
OR2.0 OR2.1-OR2.13 = hal-config:OR2: HAL OR2
SCALE.0 SCALE.1-SCALE.6 = hal-config:SCALE: Scale and offset input value Rename first device: scale.1 -> scale.0
SERVO-THREAD = hal-config:THREAD
TIMEDELAY.0 = hal-config:TIMEDELAY: Delays IN to OUT by specified number of seconds Rename first device timedelay.1 -> timedelay.0
TOGGLE.0 = hal-config:TOGGLE: On / Off from momentary input Rename first device: toggle.1 -> toggle.0